# EAGLE design untitled (EAGLE 9.6.2)
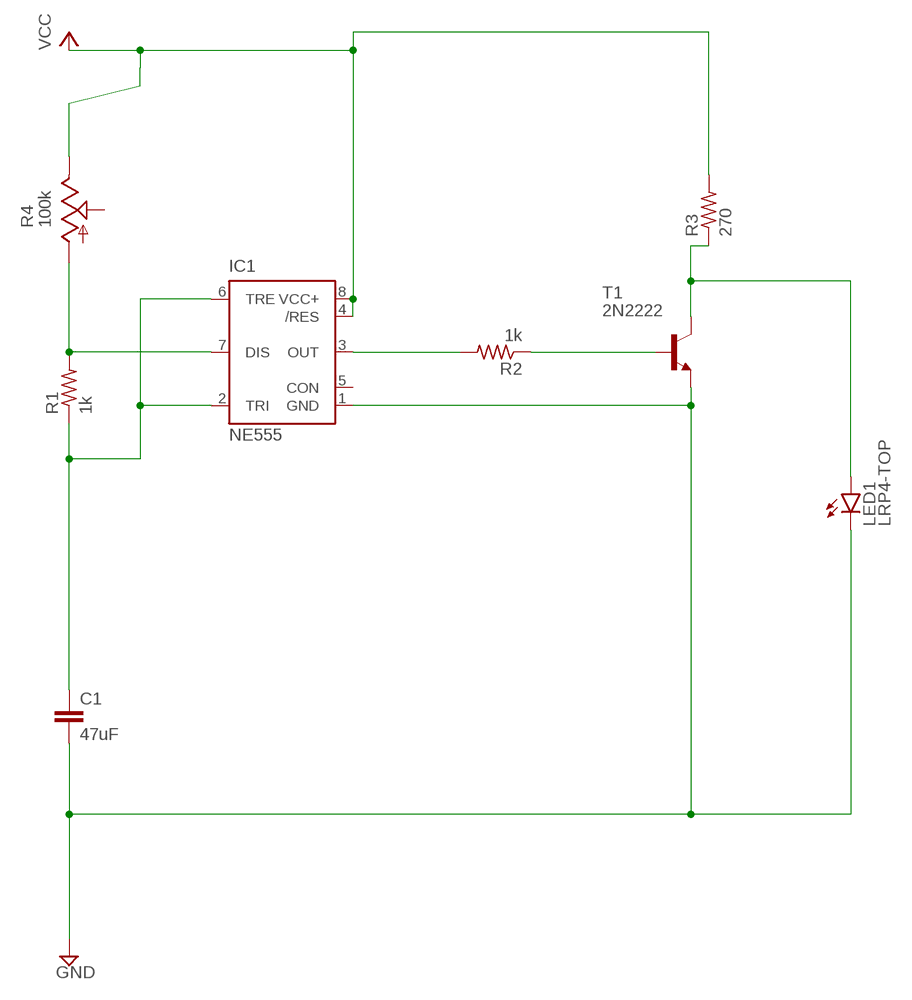
[diagram p0: schematic, sheet 1]

## Parts
C1  47uF  C-EU050-035X075  [C050-035X075]
IC1  NE555  [DIL-08]
LED1  LRP4-TOP  [P47F-TOP]
R1  1k  R-US_0204/5  [0204/5]
R2  1k  R-US_0204/5  [0204/5]
R3  270  R-US_0204/5  [0204/5]
R4  100k  TRIM_US-RJ6S  [RJ6S]
T1  2N2222  [TO18]

## Nets
GND: C1.2 IC1.1(GND) LED1.C T1.1(E)
N$2: IC1.7(DIS) R1.2 R4.A
N$4: IC1.3(OUT) R2.2
N$5: R2.1 T1.2(B)
N$6: LED1.A R3.1 T1.3(C)
N$8: C1.1 IC1.2(TRI) IC1.6(TRE) R1.1
VCC: IC1.4(/RES) IC1.8(VCC+) R3.2 R4.E
Unconnected: IC1.5(CON) R4.S

## Library data of the parts
C1 = rcl:C-EU: CAPACITOR, European symbol; SPICEPREFIX: C
IC1 = st-microelectronics:NE555: General purpose bipolar Timer; MF: Arrow Electronics; MPN: NE555N; OC_FARNELL: 1467742; OC_NEWARK: 89K1486
LED1 = led:*P4: PointLED® Enhanced Thinfilm LED TOP & BOTTOM mount LS P47F, LR P47F, LA P47F, LY P47F, LT P4SG, LB P4SG, LW P4SG Source: http://catalog.osram-os.com .. LA_LR_LS_LY_P47F_Pb_free.pdf
R1-R3 = rcl:R-US_: RESISTOR, American symbol; SPICEPREFIX: R
R4 = pot:TRIM_US-: POTENTIOMETER
T1 = transistor:2N2222: NPN TRANSISTOR

## Board
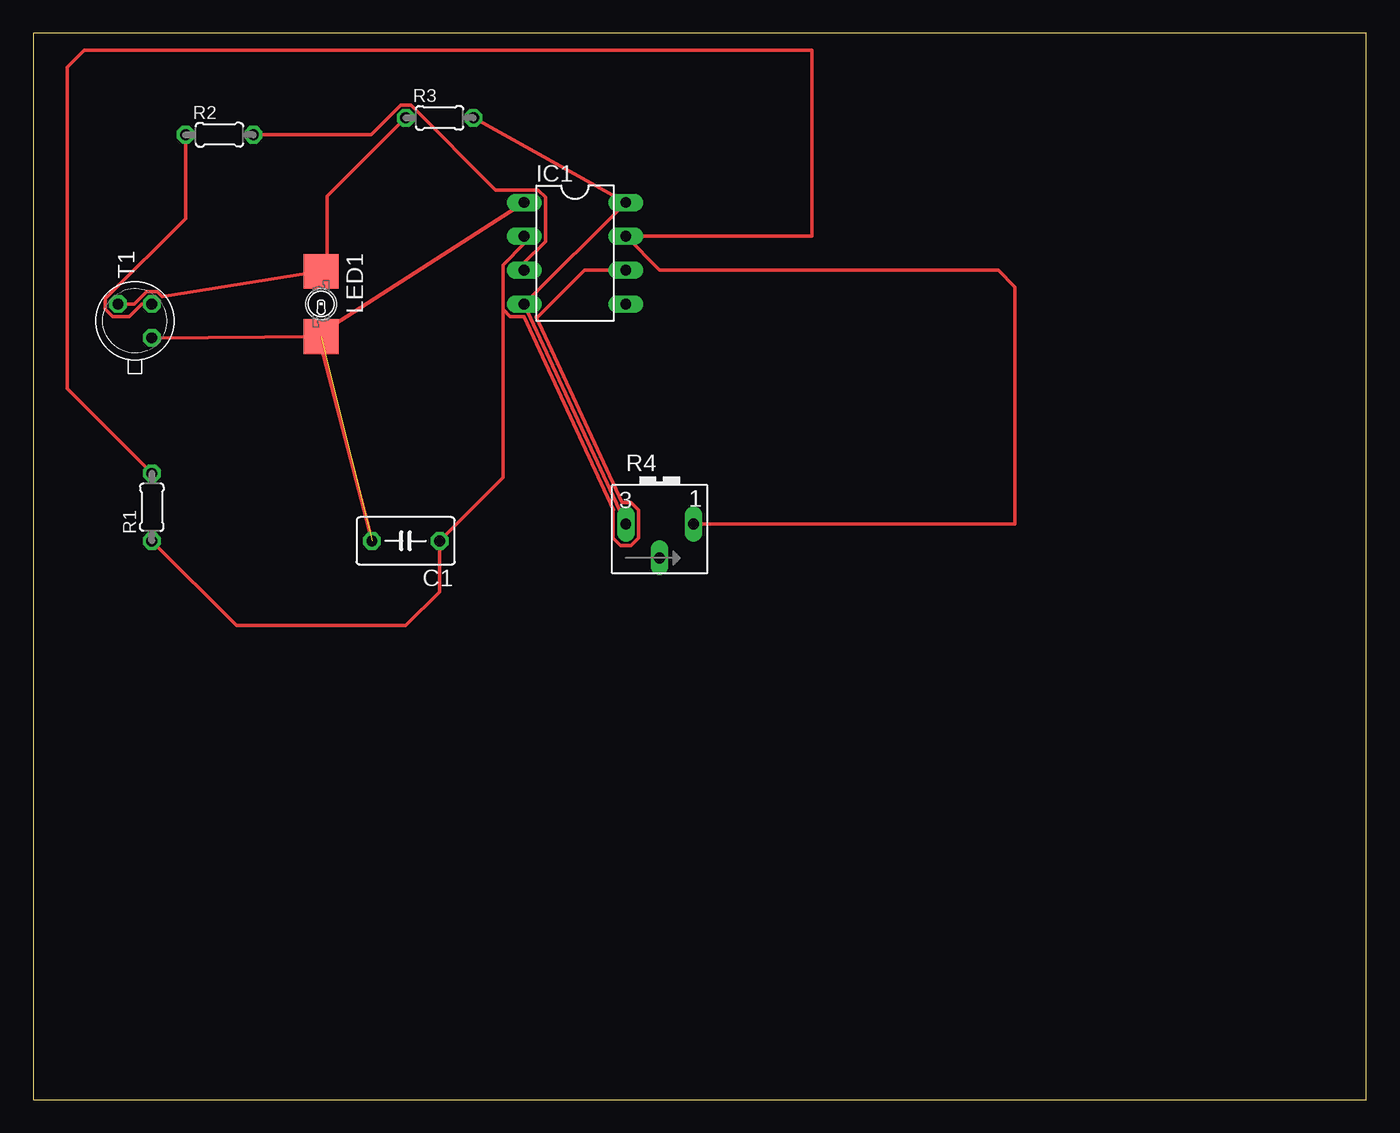
[diagram p1: board, top side]

Size 100 x 80 mm. Coordinates in mm from the lower left corner, seen from the top.
Outline: 0,0 100,0 100,80 0,80 0,0
Copper layers (1*16): Top 0.035mm / dielectric 1.5mm / Bottom 0.035mm
Design rules "default": minimum track width 6mil, minimum drill 0.35mm, track to track 6mil, track to pad 6mil, pad to pad 6mil, via to via 6mil, smd to smd 6mil, copper to edge 40mil, drill to drill 6mil, minimum pad ring 10mil, minimum via ring 8mil, stop-mask expansion 4mil, vias tented up to drill 0mil, thermal gap 10mil

### Footprints (pad centres in the part's own frame; a part is rotated, then mirrored left to right if it is on the bottom)
C050-035X075 = drill 0.813 octagon: 1 -2.54,0; 2 2.54,0
DIL-08 = drill 0.813 long: 1 -3.81,-3.81; 2 -1.27,-3.81; 3 1.27,-3.81; 4 3.81,-3.81; 5 3.81,3.81; 6 1.27,3.81; 7 -1.27,3.81; 8 -3.81,3.81
P47F-TOP = smd 2.6 x 2.6: A -2.45,0; C 2.45,0 | hole 2.3: 0,0
0204/5 = drill 0.813 octagon: 1 -2.54,0; 2 2.54,0
RJ6S = drill 0.813 long: A 2.54,0; E -2.54,0; S 0,-2.54
TO18 = drill 0.813 octagon: 1 -1.27,-1.27; 2 1.27,-1.27; 3 1.27,1.27

### Placement (x,y rotation side)
C1  27.94,41.91 180 top
IC1  40.64,63.5 270 top
LED1  21.59,59.69 270 top
R1  8.89,44.45 90 top
R2  13.97,72.39 0 top
R3  30.48,73.66 0 top
R4  46.99,43.18 0 top
T1  7.62,58.42 90 top

### Tracks (layer width: path | path; a pad name or v marks a point on that pad's centre or on a via)
GND  (1 unrouted)
  Top 0.254: IC1.1 21.52,57.48 21.48,57.48 21.37,57.37 C1.2 | LED1.C T1.1
N$2
  Top 0.254: R1.2 2.54,53.34 2.54,77.47 3.81,78.74 58.42,78.74 58.42,64.77 IC1.7 46.99,62.23 72.39,62.23 73.66,60.96 73.66,43.18 R4.A
N$4
  Top 0.254: R2.2 25.34,72.39 27.55,74.6 28.33,74.6 34.68,68.25 37.88,68.25 38.43,67.7 38.43,64.38 36.83,62.78 IC1.3
N$5
  Top 0.254: R2.1 11.43,66.1 5.41,60.08 5.41,59.3 5.96,58.75 7.2,58.75 8.14,59.69 T1.2
N$6
  Top 0.254: T1.3 7.56,59.69 8.5,60.63 9.28,60.63 9.68,60.23 LED1.A 21.86,62.41 21.89,62.41 22.05,62.57 22.05,67.78 R3.1
N$8
  Top 0.254: R1.1 15.24,35.56 27.94,35.56 30.48,38.1 C1.1 35.23,46.66 35.23,59.3 | 35.23,59.3 35.78,58.75 36.82,58.75 43.52,44.23 43.51,44.23 43.51,42.13 44.06,41.58 44.84,41.58 45.39,42.13 45.39,44.23 44.84,44.78 44.16,44.78 37.71,58.75 37.88,58.75 41.36,62.23 IC1.6 | IC1.2 36.83,64.22 35.23,62.62 35.23,59.3
VCC
  Top 0.254: R3.2 IC1.8 IC1.4 R4.E